# EAGLE design rcstick-f-tiny (EAGLE 9.6.2)
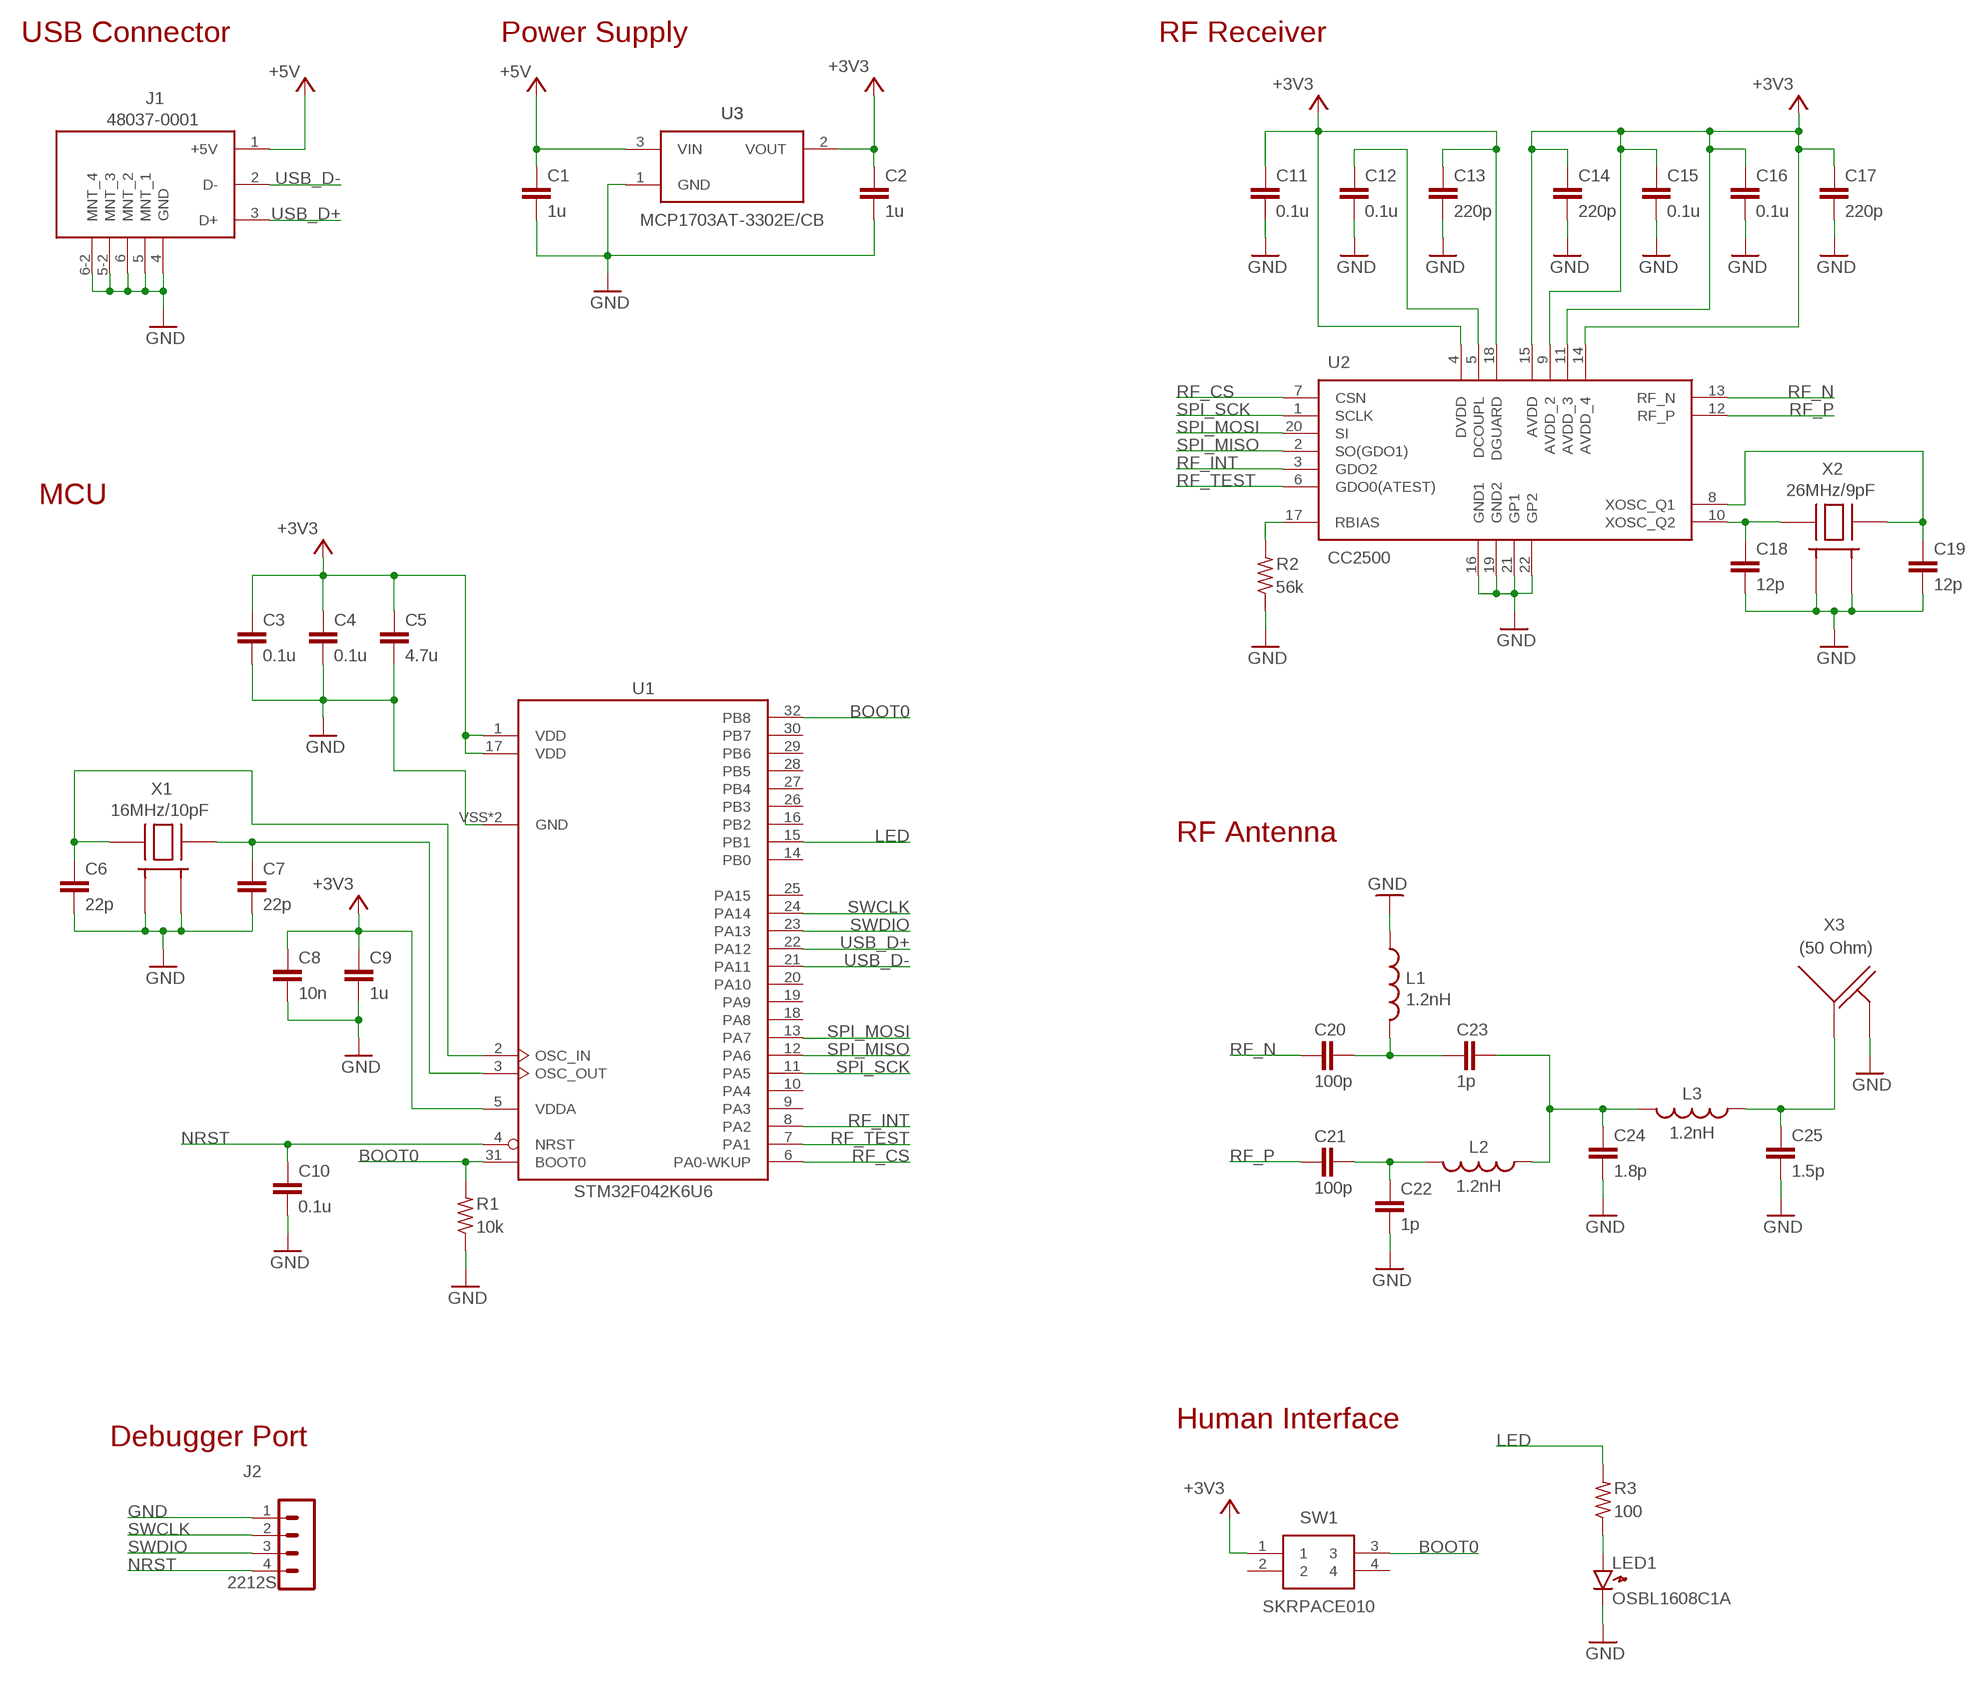
[diagram p0: schematic, sheet 1]

## Parts
C1  1u  RCL_C-EUC0402-HS  [RCL_C0402_HS]
C2  1u  RCL_C-EUC0402-HS  [RCL_C0402_HS]
C3  0.1u  RCL_C-EUC0402-HS  [RCL_C0402_HS]
C4  0.1u  RCL_C-EUC0402-HS  [RCL_C0402_HS]
C5  4.7u  RCL_C-EUC0402-HS  [RCL_C0402_HS]
C6  22p  RCL_C-EUC0402-HS  [RCL_C0402_HS]
C7  22p  RCL_C-EUC0402-HS  [RCL_C0402_HS]
C8  10n  RCL_C-EUC0402-HS  [RCL_C0402_HS]
C9  1u  RCL_C-EUC0402-HS  [RCL_C0402_HS]
C10  0.1u  RCL_C-EUC0402-HS  [RCL_C0402_HS]
C11  0.1u  RCL_C-EUC0402-HS  [RCL_C0402_HS]
C12  0.1u  RCL_C-EUC0402-HS  [RCL_C0402_HS]
C13  220p  RCL_C-EUC0402-HS  [RCL_C0402_HS]
C14  220p  RCL_C-EUC0402-HS  [RCL_C0402_HS]
C15  0.1u  RCL_C-EUC0402-HS  [RCL_C0402_HS]
C16  0.1u  RCL_C-EUC0402-HS  [RCL_C0402_HS]
C17  220p  RCL_C-EUC0402-HS  [RCL_C0402_HS]
C18  12p  RCL_C-EUC0402-HS  [RCL_C0402_HS]
C19  12p  RCL_C-EUC0402-HS  [RCL_C0402_HS]
C20  100p  RCL_C-EUC0402-HS  [RCL_C0402_HS]
C21  100p  RCL_C-EUC0402-HS  [RCL_C0402_HS]
C22  1p  RCL_C-EUC0402-HS  [RCL_C0402_HS]
C23  1p  RCL_C-EUC0402-HS  [RCL_C0402_HS]
C24  1.8p  RCL_C-EUC0402-HS  [RCL_C0402_HS]
C25  1.5p  RCL_C-EUC0402-HS  [RCL_C0402_HS]
J1  MOLEX_48037-0001  [MOLEX_48037-0001_1]
J2  2212S  53047-0410  [53047-0410]
L1  1.2nH  RCL_L-USL0402-HS  [RCL_L0402_HS]
L2  1.2nH  RCL_L-USL0402-HS  [RCL_L0402_HS]
L3  1.2nH  RCL_L-USL0402-HS  [RCL_L0402_HS]
LED1  OSBL1608C1A  LED1608  [LED1608]
R1  10k  RCL_R-US_R0402-HS  [RCL_R0402_HS]
R2  56k  RCL_R-US_R0402-HS  [RCL_R0402_HS]
R3  100  RCL_R-US_R0402-HS  [RCL_R0402_HS]
SW1  SKRPACE010  [SMT(4.2X3.2)]
U1  STM32F042K6U6  STM32F042K6U-M  [UQFPN32-M]
U2  CC2500  CC2500-HS  [CC2500-RTY1_CC2500-HS]
U3  MCP1703AT-3302E/CB  LDO-REGULATOR  [SOT23]
X1  16MHz/10pF  CRYSTAL3225HS  [CRYSTAL3225-HS]
X2  26MHz/9pF  CRYSTAL3225HS  [CRYSTAL3225-HS]
X3  (50 Ohm)  2.4GHZ-INVERED-FSMALL-FLIP  [2.4GHZ-INVERTED-F-SMALL-FLIP]

## Nets
+3V3 [pwr]: C2.1 C3.1 C4.1 C5.1 C8.1 C9.1 C11.1 C13.1 C14.1 C15.1 C16.1 C17.1 SW1.1 U1.1(VDD) U1.5(VDDA) U1.17(VDD) U2.4(DVDD) U2.9(AVDD_2) U2.11(AVDD_3) U2.14(AVDD_4) U2.15(AVDD) U2.18(DGUARD) U3.2(VOUT)
+5V [pwr]: C1.1 J1.1(+5V) U3.3(VIN)
BOOT0: R1.2 SW1.3 U1.31(BOOT0) U1.32(PB8)
DCOUPL: C12.1 U2.5(DCOUPL)
GND [gnd]: C1.2 C2.2 C3.2 C4.2 C5.2 C6.2 C7.2 C8.2 C9.2 C10.2 C11.2 C12.2 C13.2 C14.2 C15.2 C16.2 C17.2 C18.2 C19.2 C22.2 C24.2 C25.2 J1.4(GND) J1.5(MNT_1) J1.5-2(MNT_3) J1.6(MNT_2) J1.6-2(MNT_4) J2.1 L1.1 LED1.K R1.1 R2.1 U1.VSS(GND) U1.VSSH(GND) U2.16(GND1) U2.19(GND2) U2.21(GP1) U2.22(GP2) U3.1(GND) X1.2(GND_1) X1.4(GND_2) X2.2(GND_1) X2.4(GND_2) X3.2(GND)
LED: R3.2 U1.15(PB1)
N$1: LED1.A R3.1
N$5: C20.2 C23.1 L1.2
N$9: C21.2 C22.1 L2.2
N$10: C23.2 C24.1 L2.1 L3.2
N$11: C25.1 L3.1 X3.1(ANT)
NRST: C10.1 J2.4 U1.4(NRST)
OSC_IN: C6.1 U1.2(OSC_IN) X1.1(HOT_1)
OSC_OUT: C7.1 U1.3(OSC_OUT) X1.3(HOT_2)
RBIAS: R2.2 U2.17(RBIAS)
RF_CS: U1.6(PA0-WKUP) U2.7(CSN)
RF_INT: U1.8(PA2) U2.3(GDO2)
RF_N: C20.1 U2.13(RF_N)
RF_P: C21.1 U2.12(RF_P)
RF_TEST: U1.7(PA1) U2.6(GDO0(ATEST))
SPI_MISO: U1.12(PA6) U2.2(SO(GDO1))
SPI_MOSI: U1.13(PA7) U2.20(SI)
SPI_SCK: U1.11(PA5) U2.1(SCLK)
SWCLK: J2.2 U1.24(PA14)
SWDIO: J2.3 U1.23(PA13)
USB_D+: J1.3(D+) U1.22(PA12)
USB_D-: J1.2(D-) U1.21(PA11)
XOSC1: C19.1 U2.8(XOSC_Q1) X2.3(HOT_2)
XOSC2: C18.1 U2.10(XOSC_Q2) X2.1(HOT_1)
Unconnected: SW1.2 SW1.4 U1.9(PA3) U1.10(PA4) U1.14(PB0) U1.16(PB2) U1.18(PA8) U1.19(PA9) U1.20(PA10) U1.25(PA15) U1.26(PB3) U1.27(PB4) U1.28(PB5) U1.29(PB6) U1.30(PB7)

## Notes on the sheet
- USB Connector | Power Supply | RF Receiver
- MCU
- RF Antenna
- Human Interface
- Debugger Port

## Library data of the parts
C1-C25 = gen-discrete3:RCL_C-EU: CAPACITOR, European symbol
J1 = Molex-48037-0001:MOLEX_48037-0001: Universal Serial Bus (USB) Shielded I/O Plug, Type A, Right Angle, Through Hole, 0.76µm Gold (Au) Plating, PCB Thickness 1.20mm-1.60mm, Lead-Free
J2 = connector:53047-0410: HEADER
L1-L3 = gen-discrete3:RCL_L-US: INDUCTOR, American symbol
LED1 = gen-discrete:LED: Generic LEDs
R1-R3 = gen-discrete3:RCL_R-US_: RESISTOR, American symbol
SW1 = SKRPACE010:SKRPACE010: Tactile Switches 4.2x3.2x2.5mm 260gf Source: Datasheet <http://www.alps.com/prod/info/E/HTML/Tact/SurfaceMount/SKRP/SKRPACE010.html>; ARROW_PART_NUMBER: SKRPACE010; DESCRIPTION: Tactile Switches 4.2x3.2x2.5mm 260gf; HEIGHT: mm; MANUFACTURER_NAME: ALPS; MANUFACTURER_PART_NUMBER: SKRPACE010
U1 = stm32:STM32F042K6U
U2 = CC2500:CC2500: RF Transceiver Source: Datasheet
U3 = SOT23_Module:LDO-REGULATOR
X1 X2 = CRYSTAL3225:CRYSTAL3225: Crystals 3225
X3 = antenna:2.4GHZ-INVERED-F

## Net classes
1 gnd: width 0.2 mm
2 pwr: width 0.2 mm

## Board
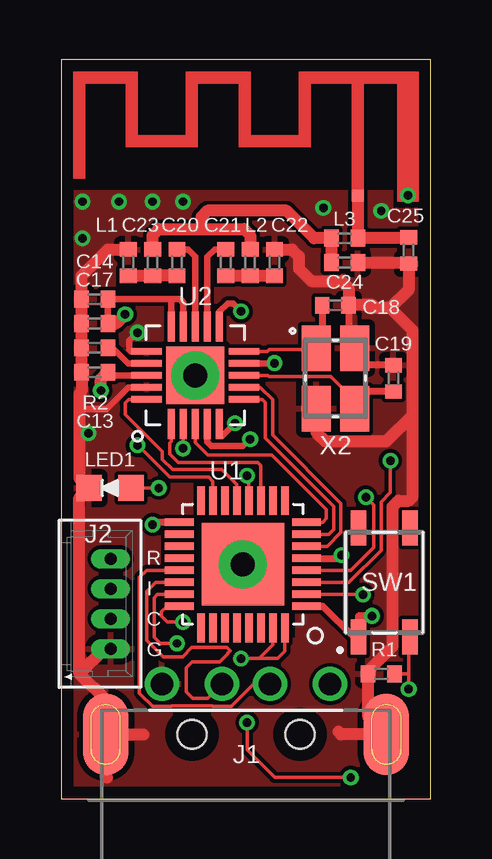
[diagram p1: board, top side]
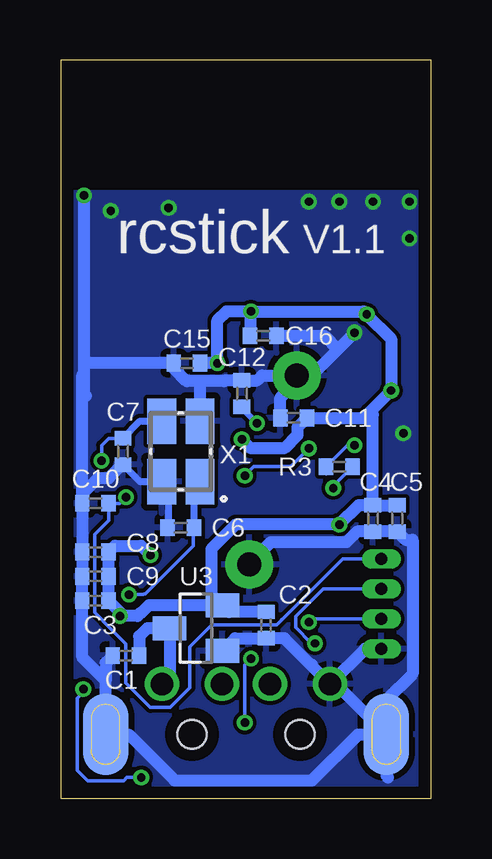
[diagram p2: board, bottom side, seen from below]

Size 15.4 x 30.8 mm. Coordinates in mm from the lower left corner, seen from the top.
Outline: 15.4,30.8 0,30.8 0,0 15.4,0 15.4,30.8
Outline: 12.95,3.33 arc-180 14.15,3.33 14.15,2.04 arc-180 12.95,2.04 12.95,3.33
Outline: 1.25,3.33 arc-180 2.45,3.33 2.45,2.04 arc-180 1.25,2.04 1.25,3.33
Copper layers (1*16): Top 0.035mm / dielectric 1.2mm / Bottom 0.035mm
Design rules "Elecrow_2-layer_PCB_eagle_rule *": minimum track width 6mil, minimum drill 12mil, track to track 6mil, track to pad 6mil, pad to pad 6mil, via to via 8mil, smd to smd 0mil, copper to edge 20mil, drill to drill 10mil, minimum pad ring 6mil, minimum via ring 6mil, stop-mask expansion 0mil, vias tented up to drill 100mil, thermal gap 10mil
tRestrict: area 9.5,6.7 to 9.7,7.6; area 3,18.8 to 4.2,19; area 11.8,17.5 to 12.6,17.8
bRestrict: area 8.9,14.2 to 11.5,14.8

### Footprints (pad centres in the part's own frame; a part is rotated, then mirrored left to right if it is on the bottom)
RCL_C0402_HS = smd 0.6 x 0.7: 1 -0.55,0; 2 0.55,0
MOLEX_48037-0001_1 = drill 0.93 pad 1.42: 1 3.5,10.5; 2 1,10.5; 3 -1,10.5; 4 -3.5,10.5 | smd 1.9 x 3.4: 5 -5.85,8.4; 6 5.85,8.4 | smd 1.9 x 3.4 bottom: 5-2 -5.85,8.4; 6-2 5.85,8.4 | hole 1.2: -2.25,8.4; 2.25,8.4
53047-0410 = drill 0.508 long: 1 1.875,0; 2 0.625,0; 3 -0.625,0; 4 -1.875,0
RCL_L0402_HS = smd 0.6 x 0.7: 1 -0.55,0; 2 0.55,0
LED1608 = smd 1.05 x 1.08: A -0.875,0; K 0.875,0
RCL_R0402_HS = smd 0.6 x 0.7: 1 -0.55,0; 2 0.55,0
SMT(4.2X3.2) = smd 1.45 x 0.65: 1 -2.275,1.075; 2 2.275,1.075; 3 -2.275,-1.075; 4 2.275,-1.075
UQFPN32-M = smd 1.2 x 0.3: 1 -2.65,1.75; 2 -2.65,1.25; 3 -2.65,0.75; 4 -2.65,0.25; 5 -2.65,-0.25; 6 -2.65,-0.75; 7 -2.65,-1.25; 8 -2.65,-1.75; 17 2.65,-1.75; 18 2.65,-1.25; 19 2.65,-0.75; 20 2.65,-0.25; 21 2.65,0.25; 22 2.65,0.75; 23 2.65,1.25; 24 2.65,1.75 | smd 0.3 x 1.2: 9 -1.75,-2.65; 10 -1.25,-2.65; 11 -0.75,-2.65; 12 -0.25,-2.65; 13 0.25,-2.65; 14 0.75,-2.65; 15 1.25,-2.65; 16 1.75,-2.65; 25 1.75,2.65; 26 1.25,2.65; 27 0.75,2.65; 28 0.25,2.65; 29 -0.25,2.65; 30 -0.75,2.65; 31 -1.25,2.65; 32 -1.75,2.65 | smd 3.45 x 3.45: VSS 0,0 | drill 1 pad 2: VSSH 0,0
CC2500-RTY1_CC2500-HS = smd 1.26 x 0.28: 1 -2.03,1; 2 -2.03,0.5; 3 -2.03,0; 4 -2.03,-0.5; 5 -2.03,-1; 11 2.03,-1; 12 2.03,-0.5; 13 2.03,0; 14 2.03,0.5; 15 2.03,1 | smd 0.28 x 1.26: 6 -1,-2.03; 7 -0.5,-2.03; 8 0,-2.03; 9 0.5,-2.03; 10 1,-2.03; 16 1,2.03; 17 0.5,2.03; 18 0,2.03; 19 -0.5,2.03; 20 -1,2.03 | smd 2.4 x 2.4: 21 0,0 | drill 1 pad 2: 22 0,0
SOT23 = smd 1 x 1.4: 1 -0.95,-1.1; 2 0.95,-1.1; 3 0,1.1
CRYSTAL3225-HS = smd 1.9 x 1.2: 1 -1.26,-0.8; 2 1.26,-0.8; 3 1.26,0.8; 4 -1.26,0.8
2.4GHZ-INVERTED-F-SMALL-FLIP = smd 0.5 x 0.5: 1 12.35,-5.45 | drill 0.35 pad 0.5: 2 14.45,-5.45

### Placement (x,y rotation side)
C1  12.7,5.97 180 bottom
C2  6.86,7.24 270 bottom
C3  13.97,8.26 180 bottom
C4  2.41,11.68 270 bottom
C5  1.4,11.68 270 bottom
C6  10.41,11.3 180 bottom
C7  12.83,14.48 270 bottom
C8  13.97,9.27 180 bottom
C9  13.97,10.29 180 bottom
C10  13.97,12.32 180 bottom
C11  5.71,15.88 180 bottom
C12  7.87,16.89 90 bottom
C13  1.4,17.78 180 top
C14  1.4,20.83 180 top
C15  10.16,18.16 180 bottom
C16  6.99,19.3 0 bottom
C17  1.4,19.81 180 top
C18  11.43,20.57 0 top
C19  13.84,17.53 90 top
C20  4.83,22.35 270 top
C21  6.86,22.35 270 top
C22  8.89,22.35 90 top
C23  3.81,22.35 90 top
C24  11.81,22.35 0 top
C25  14.48,22.86 270 top
J1  7.7,-5.71 0 top
J2  2.06,8.13 270 top
L1  2.79,22.35 270 top
L2  7.87,22.35 270 top
L3  11.81,23.37 180 top
LED1  2.03,12.95 180 top
R1  13.34,5.21 0 top
R2  1.4,18.8 0 top
R3  3.81,13.84 180 bottom
SW1  13.46,9.02 90 top
U1  7.57,9.78 180 top
U2  5.59,17.65 90 top
U3  9.78,7.11 90 bottom
X1  10.41,14.48 90 bottom
X2  11.43,17.53 270 top
X3  0,30.6 0 top

### Tracks (layer width: path | path; a pad name or v marks a point on that pad's centre or on a via)
+3V3  (via drill 0.35)
  Top 0.28: U2.18 2.07,17.65 C13.1 | U2.9 v8.88,18.15 v8.89,18.16 | C17.1 C14.1 4.57,20.83 | v7.87,14.99 7.57,14.7 6.25,14.7 6.09,14.87 U2.4 | U2.11 6.59,20.3 6.93,20.65 7.16,20.65 v7.49,20.32 | U2.14 5.09,20.69 4.95,20.83 4.57,20.83 | U2.15 4.59,20.81 4.57,20.83
  Top 0.3: 11.68,10.03 v11.68,10.16 11.55,10.03 U1.5 | U1.17 3.91,11.53 v3.81,11.43 | U1.1 10.89,8.03 12.18,6.74 SW1.1 12.39,7.62 v12.95,7.62
  Top 0.5: v1.65,17.02 1.65,17.48 C13.1 | C17.1 2.29,19.81 v2.67,20.19
  Bottom 0.5: C2.1 8.41,7.79 U3.2 | C15.1 v8.89,18.16 8.89,19.94 8.51,20.32 v7.49,20.32 | 11.63,10.11 v11.68,10.16 12.06,10.54 13.17,10.54 C9.1 C8.1 C3.1 12.95,7.79 v12.95,7.62 12.23,7.62 12.08,7.76 12.05,7.76 11.75,8.06 U3.2 | C4.1 C5.1 | C4.1 3.01,12.23 v3.81,11.43 | v3.81,11.43 3.83,11.43 | 2.54,16.13 2.79,15.88 C11.1 5.56,15.48 5.56,15.15 6.11,14.61 7.49,14.61 v7.87,14.99 | 2.54,16.13 v1.65,17.02 1.65,19.18 v2.67,20.19 2.79,20.32 v7.49,20.32 | C4.1 2.41,16 2.54,16.13 | v3.81,11.43 8.13,11.43 9.14,10.41 9.14,8.53 U3.2 | C16.1 7.49,19.35 v7.49,20.32
+5V
  Bottom 0.5: U3.3 10.96,7.2 | U3.3 10.88,5.11 J1.1 | 11.09,7.32 U3.3 | U3.3 10.96,7.03 | U3.3 11.81,7.11 12.15,6.77 C1.1
BOOT0  (via drill 0.35)
  Top 0.152: U1.31 8.82,6.41 8.26,5.84 | 8.26,5.84 v7.49,5.84 | v14.48,4.57 14.48,5.21 | 14.48,5.21 14.48,6.68 SW1.3 | R1.2 14.48,5.21 | v7.75,3.17 7.75,2.03 8.89,0.89 v12.06,0.89 | U1.32 9.32,6.15 9.02,5.84 8.26,5.84
  Bottom 0.152: v7.49,5.84 7.76,5.57 7.76,4.4 7.75,4.38 v7.75,3.17 | v14.48,4.57 14.48,4.43 14.73,4.18 14.73,1.19 14.3,0.76 12.8,0.76 12.67,0.89 v12.06,0.89
DCOUPL  (via drill 0.35)
  Top 0.28: 7.12,15.65 v7.24,15.65 6.72,15.13 6.59,15.13 U2.5
  Bottom 0.28: C12.1 7.87,16.29 v7.24,15.65
GND  (via drill 0.35)
  Top 0.28: U2.19 2.8,17.15 1.91,16.26 0.76,16.26 | U2.16 2.91,18.65 2.85,18.72 2.85,19.1 v3.17,19.43
  Top 0.3: C18.2 11.98,19.04 | C19.2 12.32,18.08
  Top 0.5: J1.5 1.85,4.12 0.76,5.21 | 13.72,20.45 12.95,20.45 13,20.49 | 13,20.57 C18.2 | 14.64,16 14.64,12.58 14.48,12.42 14.04,12.42 13.81,12.18 13.81,6.35 12.79,5.33 R1.1 12.79,3.45 J1.6 11.67,2.69 11.56,2.79 | 14.64,16 14.64,19.52 13.72,20.45 | 11.98,19.04 X2.4 12.23,18.16 12.32,18.08 | C17.2 0.89,19.85 | J2.1 1.81,6.25 0.76,5.21 | 0.76,5.21 0.76,10.79 0.76,12.55 LED1.K 0.76,13.35 0.76,16.26 0.76,16.89 0.85,16.98 C13.2 R2.1 C17.2 | J1.5 3.41,2.69 3.43,2.67 | J1.5 1.85,0.94 1.91,0.89 | C18.2 11.94,20.62 | X2.2 10.63,15.28 10.99,14.91 13.55,14.91 14.64,16 | C17.2 C14.2 0.85,21.8 1.95,22.9 L1.1 | C22.2 9.61,22.9 9.91,22.61 9.91,22.1 10.41,21.59 11.68,21.59 11.98,21.29 C18.2 | C24.2 14.44,22.35 C25.2 14.48,21.21 13.72,20.45
  Bottom 0.3: C6.2 10.92,11.35 10.92,12.93 X1.4 12.12,13.22 C7.2
  Bottom 0.5: J1.5 3.95,4.79 J1.4 | J1.4 2.73,6.25 J2.1 | J1.4 4.98,5.56 | 4.98,5.56 6.1,6.69 C2.2 8.15,6.69 U3.1 | J1.6 13.55,4.03 | J1.5 1.85,4.12 0.76,5.21 0.76,10.79 1.06,10.79 C5.2 C4.2 3.07,11.13 3.51,10.7 6.65,10.7 U1.VSSH | 4.95,5.59 4.98,5.56 | X3.2 14.45,18.03 | 14.45,18.03 14.45,16.89 14.37,16.81 | U2.22 7.03,17.65 7.24,17.44 C12.2 8.58,17.44 8.61,17.41 9.65,17.41 | 14.52,12.7 C10.2 C9.2 C8.2 C3.2 14.52,5.88 13.55,4.91 | 14.52,12.7 14.52,17.67 | J1.6 13.59,2.72 | J1.6 12.59,2.69 10.67,0.76 4.95,0.76 3.03,2.69 J1.5 | J1.5 1.85,0.96 1.78,0.89 | C11.2 6.26,16.72 5.59,17.4 U2.22 | 9.65,17.41 10.15,17.41 10.16,17.4 10.71,17.95 C15.2 14.32,18.16 14.45,18.03 | 14.52,12.7 13.85,13.37 13.41,13.37 12.85,13.93 C7.2 | J1.6 13.55,4.91 | C1.2 13.55,5.67 13.55,4.91 | X1.2 9.61,17.37 9.65,17.41 | v3.17,19.43 3.87,18.73 | 3.87,18.73 4.95,17.65 U2.22 | 3.87,18.73 4.45,19.3 C16.2
  other vias: 1.14,15.24 13.34,24.51 10.92,24.64 5.08,24.89 3.81,24.89 2.41,24.89 0.89,24.89 0.89,23.37
  pour Top: 0,25.65 15.49,25.65 15.49,-0.13 0,-0.13
  pour Bottom: -0.38,26.04 15.88,26.04 15.88,-0.51 -0.38,-0.51
LED  (via drill 0.35)
  Top 0.152: v3.17,14.73 3.2,14.73 4.52,13.41 5.79,13.41 5.8,13.42 6.14,13.42 6.32,13.23 U1.15
  Bottom 0.152: 4.36,13.55 R3.2 3.47,14.73 v3.17,14.73
N$1  (via drill 0.35)
  Top 0.152: 2.41,12.95 LED1.A v4.06,12.95
  Bottom 0.152: R3.1 3.26,13.76 | R3.1 3.3,13.8 | R3.1 4.06,13.04 v4.06,12.95
N$5
  Top 0.5: C20.2 C23.1 L1.2
N$9
  Top 0.5: C21.2 L2.2 C22.1
N$10
  Top 0.5: C23.2 3.81,23.5 4.06,23.75 5.84,23.75 | L2.1 7.87,23.5 7.62,23.75 5.84,23.75 | 5.84,23.75 5.84,24.26 6.1,24.51 9.4,24.51 10.54,23.37 L3.2 C24.1
N$11
  Top 0.5: C25.1 14.44,23.37 L3.1 X3.1
NRST  (via drill 0.35)
  Top 0.152: 10.3,9.6 U1.4 11.43,9.53 12.06,9.53 13.03,10.49 13.03,12.25 v12.7,12.57
  Bottom 0.152: v12.7,12.57 12.95,12.32 C10.1 13.42,11.6 13.99,11.03 13.99,7.77 13.64,7.41 13.64,7.39 12.7,6.45 12.7,4.83 11.68,3.81 10.85,3.81 10.03,4.62 10.03,6.33 9.12,7.24 6.42,7.24 6.2,7.47 | 6.2,7.47 6.21,7.47 | J2.4 3.66,10 6.2,7.47
OSC_IN  (via drill 0.35)
  Top 0.152: U1.2 12.55,8.53 v12.57,8.51
  Bottom 0.152: C6.1 9.91,11.26 9.91,10.54 11.91,8.54 11.95,8.54 11.98,8.51 v12.57,8.51
  Bottom 0.3: C6.1 9.86,12.97 X1.1
OSC_OUT  (via drill 0.35)
  Top 0.152: v13.72,14.1 13.72,12.77 13.33,12.38 13.33,10.36 11.99,9.02 11.43,9.02 11.42,9.03 U1.3
  Bottom 0.152: C7.1 13.42,15.03 13.72,14.73 v13.72,14.1
  Bottom 0.3: C7.1 12.12,15.74 X1.3
RBIAS
  Top 0.28: U2.17 2.8,18.15 2.16,18.8 R2.2
RF_CS
  Top 0.152: U1.6 11.09,10.53 11.66,11.1 11.66,12.32 8.81,15.16 8.81,16.64 8.3,17.14 U2.7
RF_INT
  Top 0.152: U2.3 5.59,14.85 6.1,14.33 8.78,14.33 11.05,12.06 11.05,11.68 10.89,11.53 U1.8
RF_N
  Top 0.28: C20.1 5.29,22.9 5.59,22.61 U2.13
RF_P
  Top 0.28: U2.12 6.09,22.6 6.39,22.9 C21.1
RF_TEST
  Top 0.152: U1.7 11.16,11.03 11.35,11.23 11.35,12.19 8.51,15.04 8.51,16.51 8.38,16.64 7.63,16.64 U2.6
SPI_MISO  (via drill 0.35)
  Top 0.152: U2.2 v5.09,14.61 v5.08,14.61 | U1.12 7.82,13.39 v7.75,13.46
  Bottom 0.152: v5.08,14.61 5.84,13.84 7.37,13.84 v7.75,13.46
SPI_MOSI
  Top 0.152: U2.20 3.54,16.64 2.81,16.64 2.67,16.5 2.67,16.03 4.22,14.47 4.22,14.15 4.64,13.72 6.7,13.72 7.32,13.1 U1.13
SPI_SCK
  Top 0.152: U2.1 4.59,14.9 4.52,14.84 4.52,14.38 4.87,14.03 8.2,14.03 8.32,13.9 U1.11
SWCLK  (via drill 0.35)
  Top 0.152: U1.24 4.42,8.03 4.18,7.79 4.18,7.62 4.43,7.37 v5.08,7.37
  Bottom 0.152: J2.2 4.94,7.5 v5.08,7.37
SWDIO  (via drill 0.35)
  Top 0.152: U1.23 4.9,8.51 4,8.51 3.87,8.38 3.87,6.73 4.12,6.48 v4.83,6.48
  Bottom 0.152: v4.83,6.48 4.98,6.48 5.64,7.14 5.64,7.6 4.48,8.75 J2.3
USB_D+
  Top 0.152: 4.89,9.06 U1.22 3.95,9.03 3.57,8.65 3.57,6.6 4.25,5.92 5.06,5.92 5.44,6.3 6.91,6.3 7.04,6.17 6.94,6.07 6.94,6.05 6.6,5.71 5.46,5.71 5.21,5.46 5.21,4.46 5.48,4.19 6.11,4.19 J1.3
USB_D-
  Top 0.152: U1.21 3.56,9.53 3.26,9.23 3.26,4.4 3.81,3.85 4.59,3.85 4.61,3.87 6.29,3.87 6.31,3.85 7.09,3.85 8.03,4.79 J1.2
XOSC1
  Top 0.152: X2.3 12.23,16.6 11.22,17.61 8.66,17.61 8.61,17.65 U2.8
  Top 0.3: C19.1 12.4,16.98
  Top 0.5: 12.4,16.98 12.32,16.89 12.32,16.36 X2.3
XOSC2
  Top 0.152: U2.10 8.6,18.65 8.66,18.72 10.56,18.72 X2.1
  Top 0.3: C18.1 10.88,19.04
  Top 0.5: 10.88,19.04 X2.1

### Text on the board
bPlace: V1.1 | rcstick
tNames: LED1 | R | I | C | G